# Altium schematic sheet 105358-3SC003-02-A_Cover-Touch.SchDoc: Cover- EFP1-Touch
size 420 x 297 mm; DrawnBy: Kartik Karuna; Organization: Hotswap Norden AB; Address1: Knarrarnäsgatan 7; Address2: SE-164 40 Kista; Address3: Sweden; DocumentNumber: 1; SheetNumber: 1; SheetTotal: 1; PageSetup: Record=PageOptions|CenterHorizontal=True|CenterVertical=True|PrintScale=0.98|XCorrection=1.00|YCorrection=1.00|PrintKind=0|BorderSize=5000000|LeftOffset=0|BottomOffset=0|Orientation=2|PaperLength=1000|PaperWidth=1000|Scale=100|PaperSource=7|PrintQuality=-3|MediaType=1|DitherType=10|PrintScaleMode=1|PaperKind=A3|PaperIndex=8
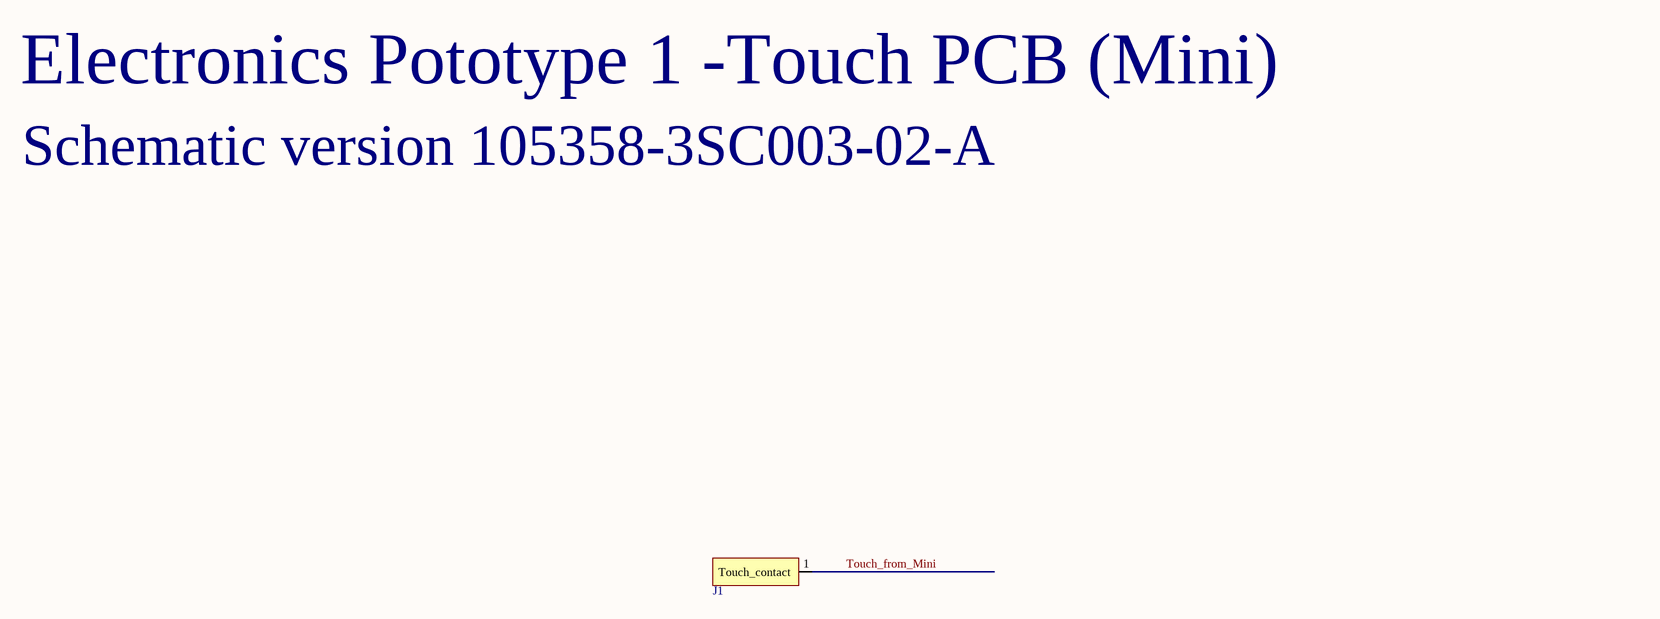
[diagram p0: 105358-3SC003-02-A_Cover-Touch.SchDoc]

## Parts
J1  COMPONENT_1  [PCBComponent_1]  (value not drawn)  (no BOM)

## Nets
Touch_from_Mini: J1.1(Touch_contact)

## Notes on the sheet
- Electronics Pototype 1 -Touch PCB (Mini)
- Schematic version 105358-3SC003-02-A
- Title
- Customer, project
- Drawn By
- Board
- Size
- Document Number
- Sheet
- of
- Last modified
- Rev
- Build
- A3